# EAGLE design Soal_1 (EAGLE 9.6.2)
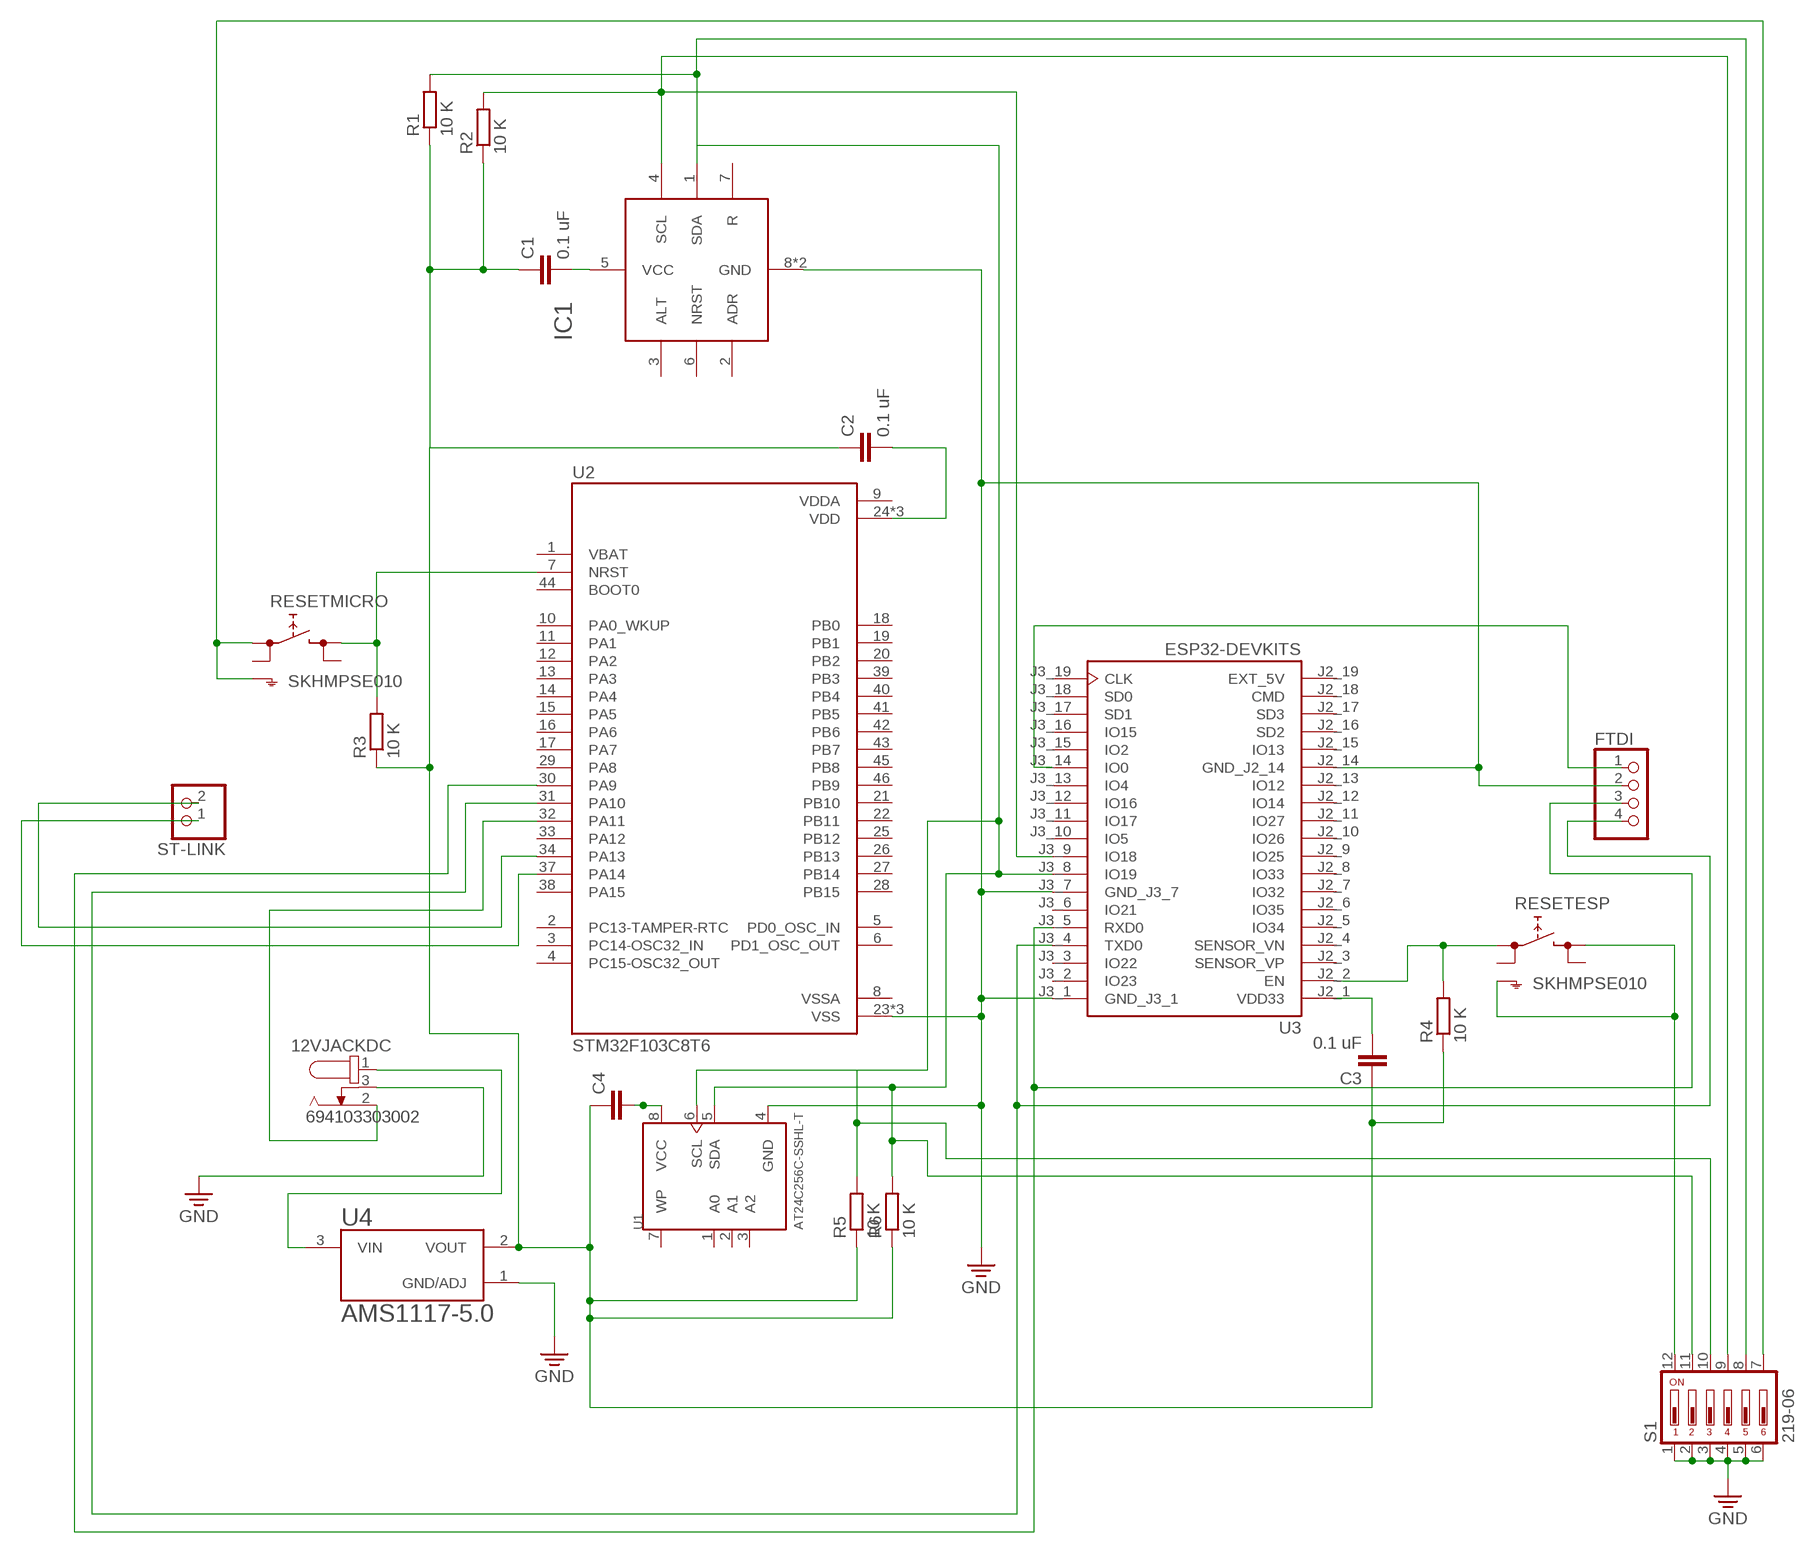
[diagram p0: schematic, sheet 1]

## Parts
12VJACKDC  694103303002  [694103303002]
C1  0.1 uF  C5/3.5  [C5B3.5]
C2  0.1 uF  C5/3.5  [C5B3.5]
C3  0.1 uF  C5/3.5  [C5B3.5]
C4  C5/3.5  [C5B3.5]
FTDI  PINHD-1X4  [1X04]
IC1  SHT31  [SON50P250X250X90-9T110X180N]
R1  10 K  R-EU_0207/10  [0207/10]
R2  10 K  R-EU_0207/10  [0207/10]
R3  10 K  R-EU_0207/10  [0207/10]
R4  10 K  R-EU_0207/10  [0207/10]
R5  10 K  R-EU_0207/10  [0207/10]
R6  10 K  R-EU_0207/10  [0207/10]
RESETESP  SKHMPSE010  [SKHMPXE010]
RESETMICRO  SKHMPSE010  [SKHMPXE010]
S1  219-06  [CTS-219-06]
ST-LINK  PINHD-1X2  [1X02]
U1  AT24C256C-SSHL-T  [SOIC127P600X175-8N]
U2  STM32F103C8T6  [QFP50P900X900X160-48N]
U3  ESP32-DEVKITS  [MODULE_ESP32-DEVKITS]
U4  AMS1117-5.0  [SOT229P700X180-4N]

## Nets
GND: 12VJACKDC.3 FTDI.2 IC1.8(GND) IC1.9(GND) S1.1 S1.2 S1.3 S1.4 S1.5 S1.6 U1.4(GND) U2.23(VSS) U2.35(VSS) U2.47(VSS) U3.J2_14(GND_J2_14) U3.J3_1(GND_J3_1) U3.J3_7(GND_J3_7) U4.1(GND/ADJ)
N$1: 12VJACKDC.1 U4.3(VIN)
N$2: C4.2 U1.8(VCC)
N$3: C1.1 C2.1 C3.1 C4.1 R1.1 R2.1 R3.1 R4.1 R5.1 R6.1 U4.2(VOUT)
N$4: C1.2 IC1.5(VCC)
N$5: C2.2 U2.24(VDD) U2.36(VDD) U2.48(VDD)
N$6: C3.2 U3.J2_1(VDD33)
N$7: R4.2 RESETESP.1(1.1) U3.J2_2(EN)
N$8: RESETESP.3(2.1) RESETESP.5(SH) S1.12
N$9: FTDI.4 U2.31(PA10) U3.J3_4(TXD0)
N$10: FTDI.3 U2.30(PA9) U3.J3_5(RXD0)
N$11: RESETMICRO.1(1.1) RESETMICRO.5(SH) S1.7
N$12: R3.2 RESETMICRO.3(2.1) U2.7(NRST)
N$13: IC1.4(SCL) R2.2 S1.9 U3.J3_9(IO18)
N$14: IC1.1(SDA) R1.2 R5.2 R6.2 S1.8 S1.10 S1.11 U1.5(SDA) U1.6(SCL) U3.J3_8(IO19)
N$15: 12VJACKDC.2 U2.32(PA11)
N$16: ST-LINK.2 U2.34(PA13)
N$17: ST-LINK.1 U2.37(PA14)
N$18: FTDI.1 U3.J3_14(IO0)
Unconnected: IC1.2(ADR) IC1.3(ALT) IC1.6(NRST) IC1.7(R) RESETESP.2(1.2) RESETESP.4(2.2) RESETMICRO.2(1.2) RESETMICRO.4(2.2) U1.1(A0) U1.2(A1) U1.3(A2) U1.7(WP) U2.1(VBAT) U2.2(PC13-TAMPER-RTC) U2.3(PC14-OSC32_IN) U2.4(PC15-OSC32_OUT) U2.5(PD0_OSC_IN) U2.6(PD1_OSC_OUT) U2.10(PA0_WKUP) U2.11(PA1) U2.12(PA2) U2.13(PA3) U2.14(PA4) U2.15(PA5) U2.16(PA6) U2.17(PA7) U2.18(PB0) U2.19(PB1) U2.20(PB2) U2.21(PB10) U2.22(PB11) U2.25(PB12) U2.26(PB13) U2.27(PB14) U2.28(PB15) U2.29(PA8) U2.33(PA12) U2.38(PA15) U2.39(PB3) U2.40(PB4) U2.41(PB5) U2.42(PB6) U2.43(PB7) U2.44(BOOT0) U2.45(PB8) U2.46(PB9) U3.J2_3(SENSOR_VP) U3.J2_4(SENSOR_VN) U3.J2_5(IO34) U3.J2_6(IO35) U3.J2_7(IO32) U3.J2_8(IO33) U3.J2_9(IO25) U3.J2_10(IO26) U3.J2_11(IO27) U3.J2_12(IO14) U3.J2_13(IO12) U3.J2_15(IO13) U3.J2_16(SD2) U3.J2_17(SD3) U3.J2_18(CMD) U3.J3_2(IO23) U3.J3_3(IO22) U3.J3_6(IO21) U3.J3_10(IO5) U3.J3_11(IO17) U3.J3_12(IO16) U3.J3_13(IO4) U3.J3_15(IO2) U3.J3_16(IO15) U3.J3_17(SD1) U3.J3_18(SD0) U3.J3_19(CLK)

## Power pins joined to a net without a drawn wire
EXT_5V: U3.J2_19(EXT_5V)
VDDA: U2.9(VDDA)
VSSA: U2.8(VSSA)

## Library data of the parts
12VJACKDC = 694103303002:694103303002: WR-DC DC Power Jack Right Angled (4.2) KIND PROPERTIES Quality Class 5 000 Mating cycles Type Right Angled MATERIAL PROPERTIES Insulator Material PA66 Insulator Flammability Rating UL94 V-0 Color Black Contact Material Copper Alloy Contact Type Stamped Center Pin Plating Gold Center Pin Terminal Plating Tin Tip Spring Material Tin Shunt Terminal Plating Tin GENERAL INFORMATION Operating Temperature -40 up to +85 °C Compliance RoHS ELECTRICAL PROPERTIES IR 1 2 A Working Voltage 30 V (AC) Withstanding Voltage 500 V (AC) Contact Resistance 50 mΩ RISO 100 MΩ PACKAGING PROPERTIES Packaging Bag <https://www.we-online.com/catalog/media/o64601v209%20Family_WR-DC_THT_6941xx303002.jpg> Details see: https://www.we-online.com/catalog/en/DC_RIGHT_ANGLED_4_2_69410X303002 Updated by Ella Wu 2021-09-30 2021(C) Wurth Elektronik Check availability <https://pricing.snapeda.com/parts/694103303002/Wurth%20Electronics/view-part?ref=eda>; AVAILABILITY: In Stock; CHECK_PRICES: https://www.snapeda.com/parts/694103303002/Wurth+Electronics/view-part/?ref=eda; DESCRIPTION: Power Barrel Connector Jack 1.35mm ID (0.053), 3.50mm OD (0.138) Through Hole, Right Angle; MF: Wurth Electronics; MP: 694103303002; PACKAGE: None; PRICE: None; PURCHASE-URL: https://www.snapeda.com/api/url_track_click_mouser/?unipart_id=559540&manufacturer=Wurth Electronics&part_name=694103303002&search_term=socket dc; SNAPEDA_LINK: https://www.snapeda.com/parts/694103303002/Wurth+Electronics/view-part/?ref=snap
C1-C4 = capacitor-wima:C: CAPACITOR naming: grid - package width
FTDI = pinhead:PINHD-1X4: PIN HEADER
IC1 = SHT31:SHT31: A I2C temp/humidity sensor Check availability <https://pricing.snapeda.com/parts/SHT31/Sensirion%20AG/view-part?ref=eda>; AVAILABILITY: In Stock; CHECK_PRICES: https://www.snapeda.com/parts/SHT31/Sensirion+AG/view-part/?ref=eda; DESCRIPTION: Humidity Temperature Sensor 0 ~ 100% RH Analog Voltage ±2% RH 8s Surface Mount; MF: Sensirion AG; MP: SHT31; PACKAGE: VFDFN-8 Sensirion AG; PRICE: None; SNAPEDA_LINK: https://www.snapeda.com/parts/SHT31/Sensirion+AG/view-part/?ref=snap
R1-R6 = rcl:R-EU_: RESISTOR, European symbol; SPICEPREFIX: R
RESETESP RESETMICRO = switch:SKHMP*E010: 6.2 X 6.5mm TACT Switch (SMD) Source: http://www3.alps.co.jp/WebObjects/catalog.woa/PDF/E/Switch/Tact/SKHM/SKHM.PDF
S1 = switch-dil:219-06*: Surface Mount DIP Switch Series 219 SMT CTS Electronic Components Sourc: www.ctscorp.com; OC_FARNELL: unknown; OC_NEWARK: unknown
ST-LINK = pinhead:PINHD-1X2: PIN HEADER
U1 = AT24C256C-SSHL-T:AT24C256C-SSHL-T: EEPROM Serial-2Wire 256K-bit 32K x 8 1.8V/2.5V/3.3V/5V 8-Pin SOIC Bulk Check availability <https://pricing.snapeda.com/parts/AT24C256CSSHLT/Microchip%20Technology/view-part?ref=eda>; AVAILABILITY: In Stock; CHECK_PRICES: https://www.snapeda.com/parts/AT24C256CSSHLT/Microchip/view-part/?ref=eda; DESCRIPTION: AT24C256C Series 256 Kb (32 K x 8) 1.7 V I2C-Compatible Serial EEPROM - SOIC-8; MF: Microchip Technology; MP: AT24C256CSSHLT; PACKAGE: None; PRICE: None; PURCHASE-URL: https://www.snapeda.com/api/url_track_click_mouser/?unipart_id=6978413&manufacturer=Microchip Technology&part_name=AT24C256CSSHLT&search_term=eeprom at24c256; SNAPEDA_LINK: https://www.snapeda.com/parts/AT24C256CSSHLT/Microchip/view-part/?ref=snap
U2 = STM32F103C8T6:STM32F103C8T6: Mainstream Performance line, ARM Cortex-M3 MCU with 64 Kbytes Flash, 72 MHz CPU, motor control, USB and CAN Check availability <https://pricing.snapeda.com/parts/STM32F103C8T6/STMicroelectronics/view-part?ref=eda>; AVAILABILITY: In Stock; CHECK_PRICES: https://www.snapeda.com/parts/STM32F103C8T6/STMicroelectronics/view-part/?ref=eda; DESCRIPTION: ARM® Cortex®-M3 STM32F1 Microcontroller IC 32-Bit 72MHz 64KB (64K x 8) FLASH 48-LQFP (7x7); MF: STMicroelectronics; MP: STM32F103C8T6; PACKAGE: LQFP-48 STMicroelectronics; PRICE: None; PURCHASE-URL: https://www.snapeda.com/api/url_track_click_mouser/?unipart_id=52195&manufacturer=STMicroelectronics&part_name=STM32F103C8T6&search_term=stm32f103c8t6; SNAPEDA_LINK: https://www.snapeda.com/parts/STM32F103C8T6/STMicroelectronics/view-part/?ref=snap
U3 = ESP32-DEVKITS:ESP32-DEVKITS: Check availability <https://pricing.snapeda.com/parts/ESP32-DEVKITS/Espressif%20Systems/view-part?ref=eda>; AVAILABILITY: In Stock; CHECK_PRICES: https://www.snapeda.com/parts/ESP32-DEVKITS/Espressif+Systems/view-part/?ref=eda; DESCRIPTION: WiFi Development Tools - 802.11 ESP32-DevKitS is a flashing board used to flash official ESP32 WROVER and SOLO series modules; MF: Espressif Systems; MP: ESP32-DEVKITS; PACKAGE: None; PRICE: None; PURCHASE-URL: https://www.snapeda.com/api/url_track_click_mouser/?unipart_id=4702132&manufacturer=Espressif Systems&part_name=ESP32-DEVKITS&search_term=esp32 module; SNAPEDA_LINK: https://www.snapeda.com/parts/ESP32-DEVKITS/Espressif+Systems/view-part/?ref=snap
U4 = AMS1117-5.0:AMS1117-5.0: Check availability <https://pricing.snapeda.com/parts/AMS1117-5.0/ams/view-part?ref=eda>; AVAILABILITY: In Stock; CHECK_PRICES: https://www.snapeda.com/parts/AMS1117-5.0/ams/view-part/?ref=eda; DESCRIPTION: 1A LOW DROPOUT VOLTAGE REGULATOR; MF: ams; MP: AMS1117-5.0; PACKAGE: SOT-223 Seeed Technology; PRICE: None; SNAPEDA_LINK: https://www.snapeda.com/parts/AMS1117-5.0/ams/view-part/?ref=snap

## Board
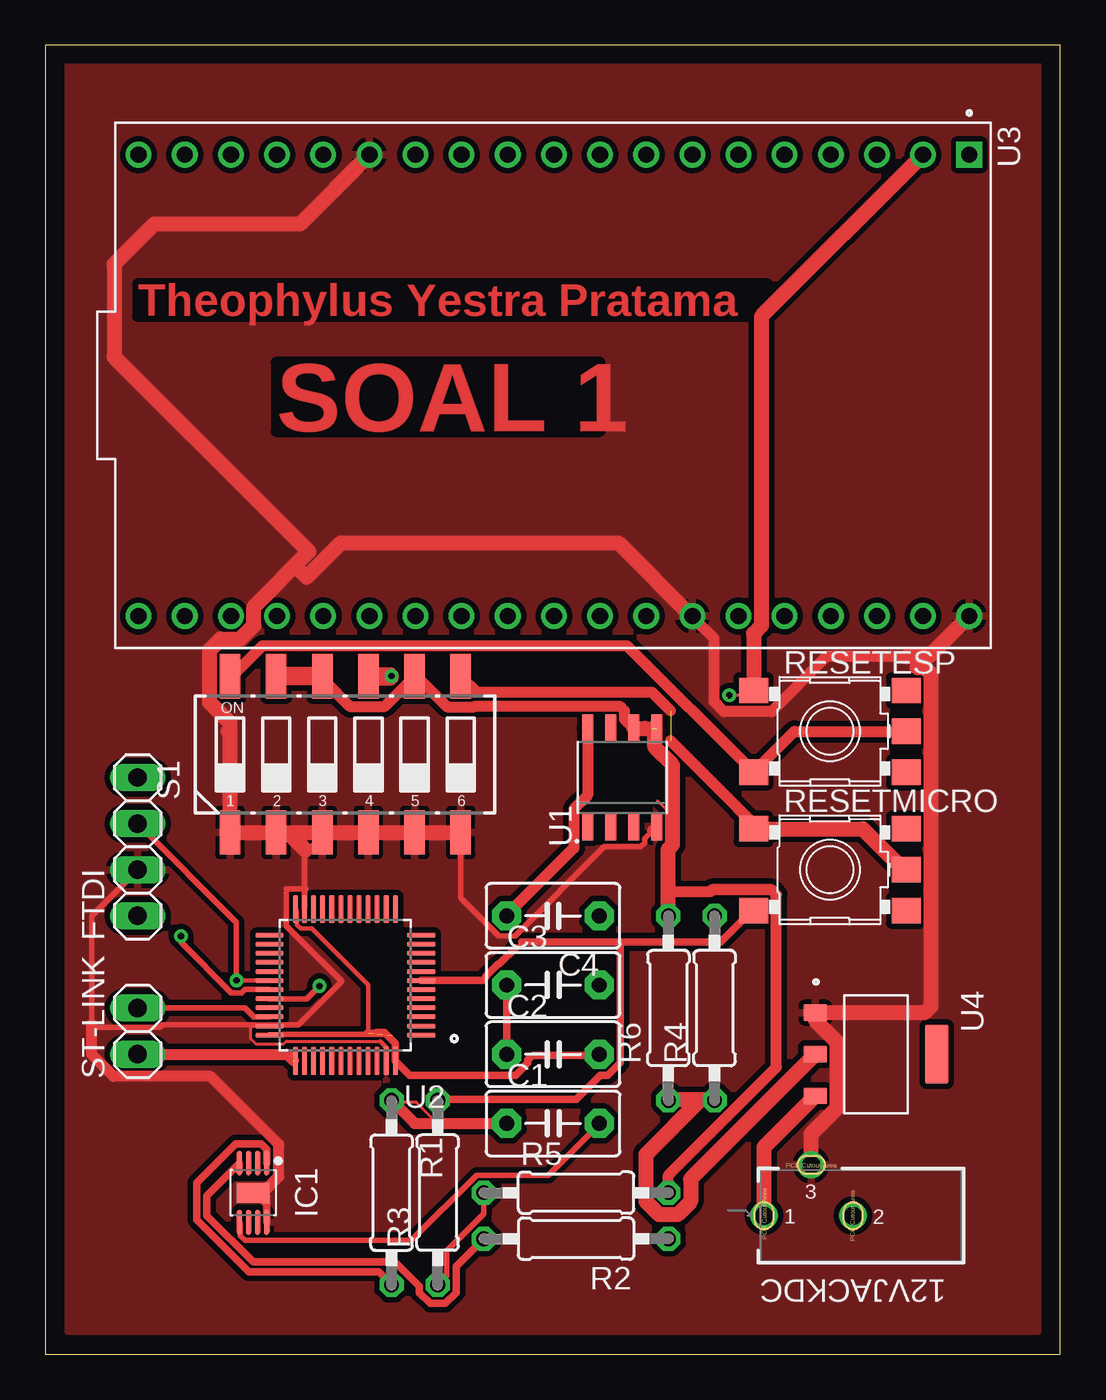
[diagram p1: board, top side]
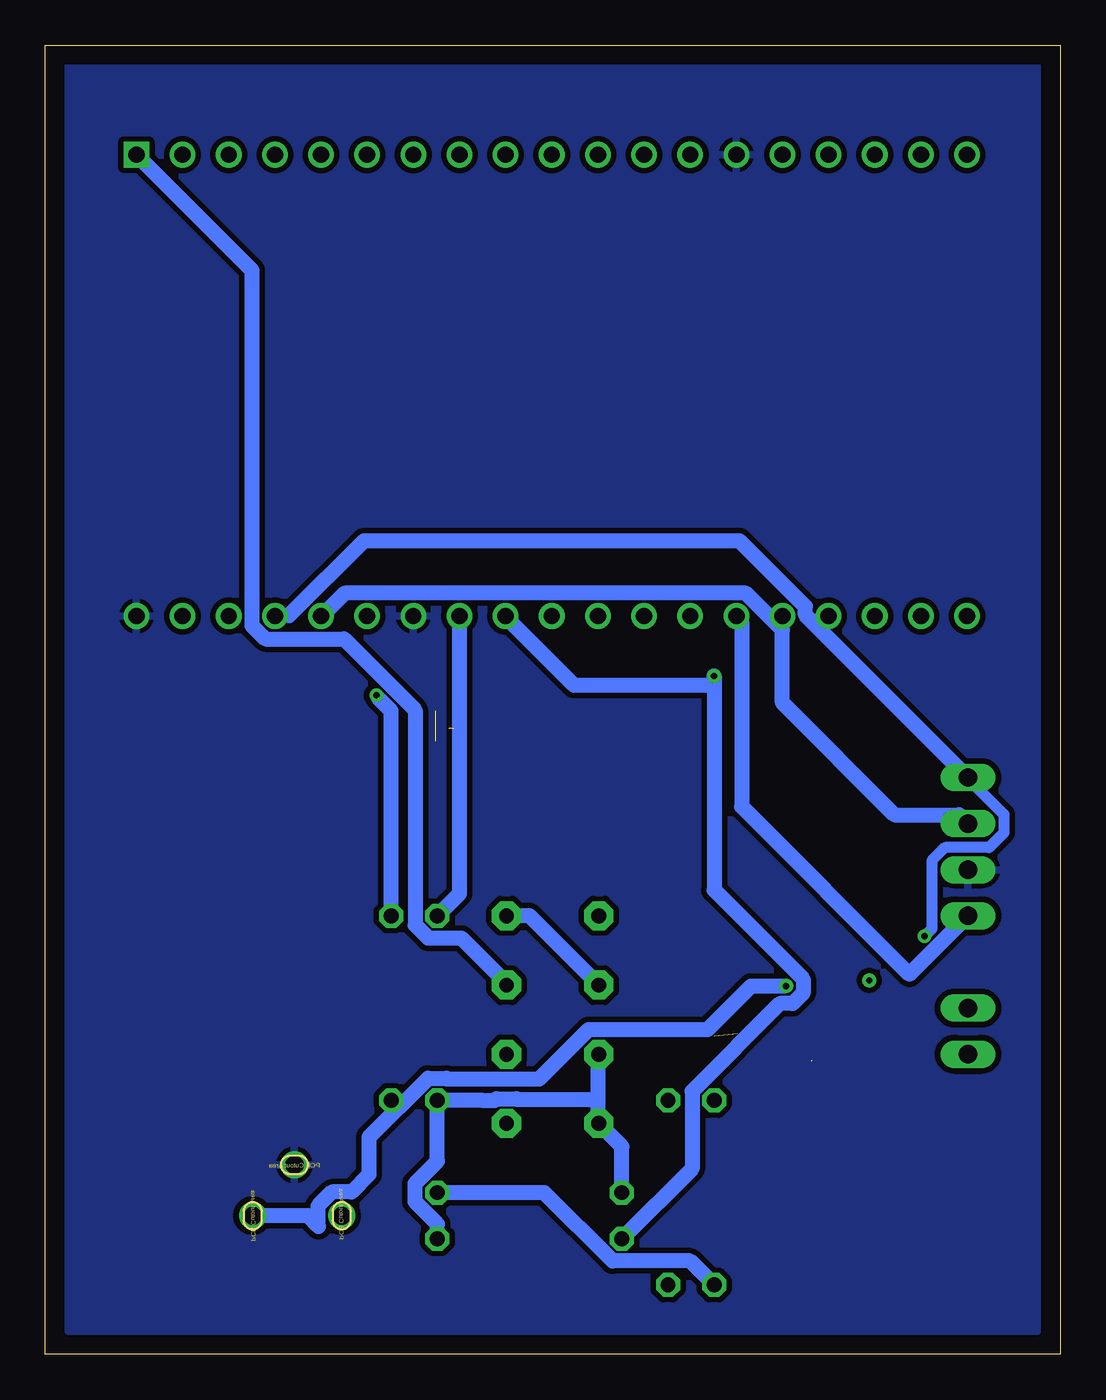
[diagram p2: board, bottom side, seen from below]

Size 55.86 x 72.06 mm. Coordinates in mm from the lower left corner, seen from the top.
Outline: 0,0 55.86,0 55.86,72.06 0,72.06 0,0
Copper layers (1*16): Top 0.035mm / dielectric 1.5mm / Bottom 0.035mm
Design rules "default *": minimum track width 6mil, minimum drill 0.35mm, track to track 12mil, track to pad 12mil, pad to pad 12mil, via to via 12mil, smd to smd 12mil, copper to edge 40mil, drill to drill 24mil, minimum pad ring 10mil, minimum via ring 8mil, stop-mask expansion 4mil, vias tented up to drill 0mil, thermal gap 10mil

### Footprints (pad centres in the part's own frame; a part is rotated, then mirrored left to right if it is on the bottom)
694103303002 = drill 1 pad 1.5: 1 4.9,0; 2 0,0; 3 2.3,-2.8
C5B3.5 = drill 0.813 pad 1.6 octagon: 1 -2.54,0; 2 2.54,0
1X04 = drill 1.016 long: 1 -3.81,0; 2 -1.27,0; 3 1.27,0; 4 3.81,0
SON50P250X250X90-9T110X180N = smd 1.4 x 0.282: 1 -1.625,0.75; 2 -1.625,0.25; 3 -1.625,-0.25; 4 -1.625,-0.75; 5 1.625,-0.75; 6 1.625,-0.25; 7 1.625,0.25; 8 1.625,0.75 | smd 1.1 x 1.8: 9 0,0
0207/10 = drill 0.813 octagon: 1 -5.08,0; 2 5.08,0
SKHMPXE010 = smd 1.6 x 1.4: 1 -4.2,2.25; 2 4.2,2.25; 3 -4.2,-2.25; 4 4.2,-2.25; 5 4.2,0
CTS-219-06 = smd 1.13 x 2.44: 1 -6.35,-4.3; 2 -3.81,-4.3; 3 -1.27,-4.3; 4 1.27,-4.3; 5 3.81,-4.3; 6 6.35,-4.3; 7 6.35,4.3; 8 3.81,4.3; 9 1.27,4.3; 10 -1.27,4.3; 11 -3.81,4.3; 12 -6.35,4.3
1X02 = drill 1.016 long: 1 -1.27,0; 2 1.27,0
SOIC127P600X175-8N = smd 1.55 x 0.6: 1 -2.7,1.905; 2 -2.7,0.635; 3 -2.7,-0.635; 4 -2.7,-1.905; 5 2.7,-1.905; 6 2.7,-0.635; 7 2.7,0.635; 8 2.7,1.905
QFP50P900X900X160-48N = smd 1.56 x 0.28: 1 -4.18,2.75; 2 -4.18,2.25; 3 -4.18,1.75; 4 -4.18,1.25; 5 -4.18,0.75; 6 -4.18,0.25; 7 -4.18,-0.25; 8 -4.18,-0.75; 9 -4.18,-1.25; 10 -4.18,-1.75; 11 -4.18,-2.25; 12 -4.18,-2.75; 25 4.18,-2.75; 26 4.18,-2.25; 27 4.18,-1.75; 28 4.18,-1.25; 29 4.18,-0.75; 30 4.18,-0.25; 31 4.18,0.25; 32 4.18,0.75; 33 4.18,1.25; 34 4.18,1.75; 35 4.18,2.25; 36 4.18,2.75 | smd 0.28 x 1.56: 13 -2.75,-4.18; 14 -2.25,-4.18; 15 -1.75,-4.18; 16 -1.25,-4.18; 17 -0.75,-4.18; 18 -0.25,-4.18; 19 0.25,-4.18; 20 0.75,-4.18; 21 1.25,-4.18; 22 1.75,-4.18; 23 2.25,-4.18; 24 2.75,-4.18; 37 2.75,4.18; 38 2.25,4.18; 39 1.75,4.18; 40 1.25,4.18; 41 0.75,4.18; 42 0.25,4.18; 43 -0.25,4.18; 44 -0.75,4.18; 45 -1.25,4.18; 46 -1.75,4.18; 47 -2.25,4.18; 48 -2.75,4.18
MODULE_ESP32-DEVKITS = drill 0.9 square: J2_1 -12.7,22.91 | drill 0.9: J2_2 -12.7,20.37; J2_3 -12.7,17.83; J2_4 -12.7,15.29; J2_5 -12.7,12.75; J2_6 -12.7,10.21; J2_7 -12.7,7.67; J2_8 -12.7,5.13; J2_9 -12.7,2.59; J2_10 -12.7,0.05; J2_11 -12.7,-2.49; J2_12 -12.7,-5.03; J2_13 -12.7,-7.57; J2_14 -12.7,-10.11; J2_15 -12.7,-12.65; J2_16 -12.7,-15.19; J2_17 -12.7,-17.73; J2_18 -12.7,-20.27; J2_19 -12.7,-22.81; J3_1 12.7,22.91; J3_2 12.7,20.37; J3_3 12.7,17.83; J3_4 12.7,15.29; J3_5 12.7,12.75; J3_6 12.7,10.21; J3_7 12.7,7.67; J3_8 12.7,5.13; J3_9 12.7,2.59; J3_10 12.7,0.05; J3_11 12.7,-2.49; J3_12 12.7,-5.03; J3_13 12.7,-7.57; J3_14 12.7,-10.11; J3_15 12.7,-12.65; J3_16 12.7,-15.19; J3_17 12.7,-17.73; J3_18 12.7,-20.27; J3_19 12.7,-22.81
SOT229P700X180-4N = smd 0.93 x 1.31: 1 -2.29,-3.345; 2 0,-3.345; 3 2.29,-3.345 | smd 3.24 x 1.31: 4 0,3.345

### Placement (x,y rotation side)
12VJACKDC  44.45,7.62 180 top
C1  27.94,12.7 0 top
C2  27.94,16.51 0 top
C3  27.94,20.32 0 top
C4  27.94,24.13 180 top
FTDI  5.08,27.94 90 top
IC1  11.43,8.89 270 top
R1  19.05,8.89 270 top
R2  29.21,6.35 180 top
R3  21.59,8.89 90 top
R4  36.83,19.05 90 top
R5  29.21,8.89 0 top
R6  34.29,19.05 90 top
RESETESP  43.18,34.29 0 top
RESETMICRO  43.18,26.67 0 top
S1  16.51,33.02 0 top
ST-LINK  5.08,17.78 90 top
U1  31.75,31.75 90 top
U2  16.51,20.32 180 top
U3  27.94,53.34 270 top
U4  45.72,16.51 270 top

### Tracks (layer width: path | path; a pad name or v marks a point on that pad's centre or on a via)
GND
  Top 0.152: 11.89,8.38 11.43,8.84 IC1.9 11.89,8.38 | 11.89,8.38 12.19,8.08 12.19,7.31 IC1.8 | 18.44,17.22 13.26,17.22 13.11,17.07 11.58,17.07 11.28,17.37 11.28,18.14 11.43,18.14 12.19,18.14 U2.35 12.34,18.14 13.87,18.14 15.7,19.96 | S1.1 10.21,28.65 12.65,28.65 S1.2 | 15.24,28.65 14.33,27.74 14.33,25.6 14.33,24.54 U2.23 | 15.24,28.65 17.68,28.65 S1.4 17.83,28.65 20.27,28.65 S1.5 20.42,28.65 22.86,28.65 | 15.24,28.65 S1.3 | 22.86,27.94 22.86,28.65 | 22.86,28.65 S1.6 | 13.26,25.6 13.26,25.4 | 42.22,10.52 12VJACKDC.3 | 35.66,40.54 U3.J3_7 35.51,40.69 | 17.83,65.99 U3.J2_14 | 47.4,38.41 47.98,37.82 | 10.06,34.29 10.06,35.2 9.3,35.97 9.3,38.71 10.21,39.62 10.52,39.62 11.73,40.84 11.73,41
  Top 0.254: 18.44,17.22 18.76,16.9 U2.47
  Top 0.305: 33.42,28.81 32.99,28.38 32.99,28.15 32.78,27.94 30.77,27.94 25.86,23.02 24.94,23.02 22.86,25.11 22.86,27.94 | U2.23 14.26,27.67 14.33,27.74 | 14.33,25.6 13.26,25.6 | 13.26,25.4 13.26,23.58 16.31,20.53 13.91,18.12 11.46,18.12 11.45,18.14 11.43,18.14 6.44,18.14 6.28,17.98 2.69,17.98 2.54,18.14 2.54,24.13 FTDI.2
  Top 0.406: IC1.8 12.18,8.67
  Top 0.61: U1.4 33.42,28.81 | 47.4,38.41 42.99,38.41 39.97,35.38 37.35,35.38 36.81,35.92 36.81,39.39 35.66,40.54 | 2.54,18.14 2.54,16.51 3.76,15.29 9.1,15.29 12.85,11.54 12.85,9.78 11.96,8.89 IC1.9
  Top 0.813: 10.16,34.19 S1.1 S1.6 | 10.06,34.29 10.16,34.19 | 10.16,34.19 10.16,34.74 9.04,35.87 9.04,38.77 9.64,39.38 10.73,39.38 11.47,40.12 11.47,41.15 14.5,44.18 3.78,54.91 3.78,60.01 6,62.23 14.02,62.23 U3.J2_14 | U3.J3_1 48.61,38.41 47.4,38.41 | 47.98,37.82 48,37.8 48.41,37.8 48.74,37.47 48.74,19.14 48.39,18.8 U4.1 42.38,18.38 43.59,17.17 43.59,13.56 42.15,12.13 12VJACKDC.3 | S1.2 13.34,28.72 14.33,27.74 | 13.74,43.41 14.37,42.78 16.28,44.68 31.52,44.68 35.66,40.54
  pour Bottom: 1.27,71.12 54.61,71.12 54.61,1.27 1.27,1.27
  pour Top: 1.27,72.39 54.61,72.39 54.61,1.27 1.27,1.27
N$1
  Top 0.813: U4.3 39.55,11.4 12VJACKDC.1
N$2
  Top 0.152: 25.45,24.23 C4.2
  Top 0.61: U1.8 29.84,30.77 29.09,30.01 29.09,27.87 25.45,24.23
N$3
  Top 0.152: R6.1 34.29,14.02 36.08,14.02 36.73,14.02 R4.1 | R1.1 19.05,13.87 20.42,13.87 21.49,12.8 25.3,12.8 C1.1
  Top 0.305: R3.1 22.1,4.32 22.1,5.68 24.13,7.71 R5.1
  Top 0.406: C3.1 C2.1
  Top 0.61: R1.1 20.32,12.7 C1.1
  Top 0.813: U4.2 35.51,9.64 35.51,8.38 34.8,7.67 33.78,7.67 33.07,8.38 33.07,11.01 36.08,14.02 | R6.1 34.34,14.02 36.73,14.02
  Bottom 0.152: R6.1 34.29,10.21 35.2,9.3 | 25.45,16.46 25.45,14.02 25.45,12.8 C1.1
  Bottom 0.813: C3.1 29.21,24.13 C4.1 | C2.1 25.45,16.46 25.45,12.8 | R5.1 24.13,11.43 C1.1 | R2.1 34.29,7.17 35.51,8.38 35.51,9.4 34.29,10.61 R6.1 | R6.1 34.29,14.02 | R6.1 31.75,13.97 31.13,13.97 31.04,14.06 29.92,14.06 29.88,14.02 25.45,14.02
N$4
  Top 0.152: 30.48,12.65 C1.2
  Top 0.305: IC1.5 10.73,7.21 10.73,6.52 10.99,6.26 20.14,6.26 23.73,9.85 27.69,9.85 30.48,12.65
N$5  (1 unrouted)
  Top 0.152: 19.05,17.53 17.78,17.53 17.27,17.53 12.34,17.53 U2.36 | 19.2,16.15 U2.48 19.36,16 19.96,15.39 25.4,15.39
  Top 0.254: 17.78,17.78 17.78,20.32 14.66,23.44 14.05,23.44 13.84,23.64 13.84,24.31 13.83,24.32 13.83,24.43 U2.24
  Top 0.305: U2.36 13.07,17.57 13.1,17.6 17.6,17.6 17.78,17.78
  Top 0.406: C2.2 30.43,16.46 26.82,16.46 26.56,16.19 26.56,16.03 25.88,15.35 20.05,15.35 U2.48 19.26,17.03 19.26,17.09 19.24,17.1 18.64,17.7 18.24,17.7 18.19,17.65 17.78,17.65
N$6
  Bottom 0.152: 30.48,20.42 C3.2
  Bottom 0.813: U3.J2_1 44.49,59.68 44.49,40.12 43.75,39.38 39.42,39.38 35.51,35.46 35.51,23.62 34.8,22.91 32.97,22.91 30.48,20.42
N$7  (via drill 0.35)  (1 unrouted)
  Top 0.152: v37.64,36.27 38.71,36.27 38.86,36.42 RESETESP.1
  Top 0.813: RESETESP.1 38.98,39.68 39.41,40.12 39.41,57.14 U3.J2_2
  Bottom 0.152: v37.64,36.27 37.52,36.14
  Bottom 0.813: R4.2 36.83,35.42 37.54,36.12
N$8
  Top 0.152: 10.21,37.34 S1.12
  Top 0.61: RESETESP.5 41.23,34.29 RESETESP.3 32.02,39 11.95,39 10.29,37.34 10.21,37.34
N$9  (via drill 0.35)
  Top 0.152: 10.01,20.17 7.47,22.71 v7.47,23.01
  Top 0.305: U2.31 10.98,20.07 10.8,19.89 10.23,19.89 7.47,22.66 v7.47,23.01
  Bottom 0.152: 4.77,31.75 FTDI.4 | 43.19,40.66 U3.J3_4
  Bottom 0.61: v7.47,23.01 7.06,23.42 7.06,27.17 6.35,27.89 3.91,27.89 3.1,28.7 3.1,29.71 5.08,31.7 FTDI.4
  Bottom 0.813: 43.19,40.66 42.46,40.66 38.34,44.78 17.64,44.78 14.03,41.16 14.03,40.7 FTDI.4
N$10  (via drill 0.35)
  Top 0.254: v10.52,20.57 11.43,20.57 U2.30
  Top 0.305: FTDI.3 10.52,23.77 v10.52,20.57
  Bottom 0.813: U3.J3_5 40.66,40.64 39.4,41.9 17.31,41.9 15.3,39.89 15.3,35.87 9.13,29.7 5.56,29.7 FTDI.3
N$11  (1 unrouted)
  Top 0.152: RESETMICRO.5 47.24,26.67 47.12,26.8 45.11,28.8 39.37,28.8 39.01,28.8 RESETMICRO.1 38.86,28.96 37.95,29.87 | 22.86,37.19 S1.7
  Top 0.61: S1.7 23.74,36.44 33.38,36.44 34.41,35.41 | 39.37,28.8 34.41,33.76
  Top 0.813: RESETMICRO.1 44.99,28.92 47.12,26.8
N$12
  Top 0.152: 25.88,22.38 26.21,22.71 31.55,22.71 | 31.75,22.71 31.55,22.71 | 38.35,23.88 38.86,24.38 RESETMICRO.3 | 31.55,22.71 31.55,16.51
  Top 0.406: U2.7 24.08,20.57 24.24,20.74 24.24,20.8 24.92,21.48 24.98,21.48 25.88,22.38 | 26.21,22.71 31.75,22.71 | 31.75,22.71 36.83,22.71 37.19,22.71 38.35,23.88 | R3.2 21.64,14.02 29.21,14.02 30.54,15.35 30.96,15.35 31.64,16.03 31.64,22.59 31.75,22.71
N$13  (via drill 0.35)
  Top 0.152: v19.05,37.34 17.83,37.34 S1.9
  Top 0.406: 10.68,10.09 IC1.4 8.89,8.72 8.89,7.62 11.43,5.08 19.22,5.08 20.57,3.72 20.57,3.39 21.17,2.79 22.01,2.79 22.61,3.39 22.61,4.83 R2.2
  Top 1.016: S1.9 18.95,37.32
  Bottom 0.813: U3.J3_9 30.53,40.59 26.77,36.83 19.05,36.83 | v19.05,37.34 19.05,36.83 | 19.05,36.83 19.05,25.56 14.15,20.66 14.15,19.88 14.73,19.3 15.44,19.3 20.27,14.47 20.27,10.21 R2.2
N$14  (2 unrouted)
  Top 0.152: 12.19,10.52 IC1.1 | 15.24,37.34 S1.10 15.24,37.19 15.42,37.01 | 33.02,34.44 33.53,34.44 | 33.68,30.48 34.29,29.87 34.29,25.45 39.78,25.45 40.08,25.15 40.08,23.62 | R5.2 34.29,10.06 38.86,14.63
  Top 0.406: R5.2 34.29,9.88 40.14,15.72 40.14,25.27 39.93,25.48 36.74,25.48 36.66,25.4 34.29,25.4 | R1.2 18.34,4.52 11.2,4.52 8.33,7.39 8.33,9.43 10.47,11.57 11.89,11.57 12.19,11.26 12.19,10.52
  Top 0.61: U1.6 31.87,34.96 31.87,35.41 31.6,35.68 23.65,35.68 23.61,35.64 22.11,35.64 20.43,37.32 S1.8 18.64,35.64 16.78,35.64 15.42,37.01 | R5.2 34.29,9.85 40.24,15.8 40.24,25.31 39.97,25.58 36.7,25.58 36.57,25.45 34.29,25.45
  Top 0.813: R6.2 34.29,25.4 34.29,25.45 34.29,27.82 34.52,28.05 34.52,32.43 33.55,33.4 33.55,34.29 33.4,34.44 | U1.6 33.01,34.45 33.02,34.44
  Top 1.016: S1.11 12.72,37.34 15.24,37.34
  Bottom 0.813: U3.J3_8 33.07,25.35 R6.2 | R1.2 20.37,5.13 24.64,5.13 28.39,8.89 R5.2
N$15  (via drill 0.35)
  Top 0.305: U2.32 14.39,19.57 v15.09,20.27
  Bottom 0.152: 15.24,20.27 v15.09,20.27
  Bottom 0.813: 40.86,7.08 41.41,7.62 12VJACKDC.2 | 15.24,20.27 17.02,20.27 19.41,17.87 25.96,17.87 28.68,15.15 33.75,15.15 33.78,15.19 34.8,15.19 38.05,11.94 38.05,9.89 39.01,8.93 40.09,8.93 40.86,8.16 40.86,7.08 | 40.86,7.08 40.82,7.03
N$16
  Top 0.152: 11.43,18.59 12.19,18.59 U2.34
  Top 0.305: ST-LINK.2 10.97,19.05 11.43,18.59 11.45,18.57 U2.34
N$17  (1 unrouted)
  Top 0.152: 13.72,16.15 U2.37
  Top 0.61: ST-LINK.1 13.31,16.51 13.66,16.15
N$18
  Bottom 0.813: U3.J3_14 17.53,40.34 17.53,30.14 8.3,20.91 FTDI.1

### Text on the board
Top: Theophylus Yestra Pratama | SOAL 1